# EAGLE design ottawa-badge-r2 (EAGLE 5.12)
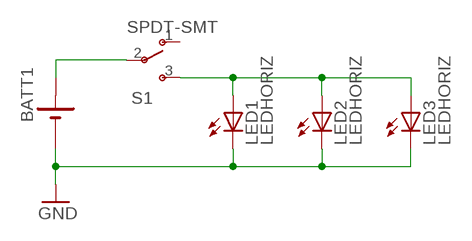
[diagram p0: schematic, sheet 1]

## Parts
BATT1  2032SMD  [2032SMD]
LED1  LEDHORIZ  [5MMLED-HORIZ]
LED2  LEDHORIZ  [5MMLED-HORIZ]
LED3  LEDHORIZ  [5MMLED-HORIZ]
S1  SPDT-SMT  [SPDT-SMT]

## Nets
GND: BATT1.- LED1.K(C) LED2.K(C) LED3.K(C)
N$1: BATT1.+ S1.2(P)
N$2: LED1.A LED2.A LED3.A S1.3(S)
Unconnected: S1.1(O)

## Library data of the parts
BATT1 = rbg-4ucon-battery:2032SMD
LED1-LED3 = artwork:LED
S1 = smt-spdt-aliexpress:SPDT-SMT

## Board
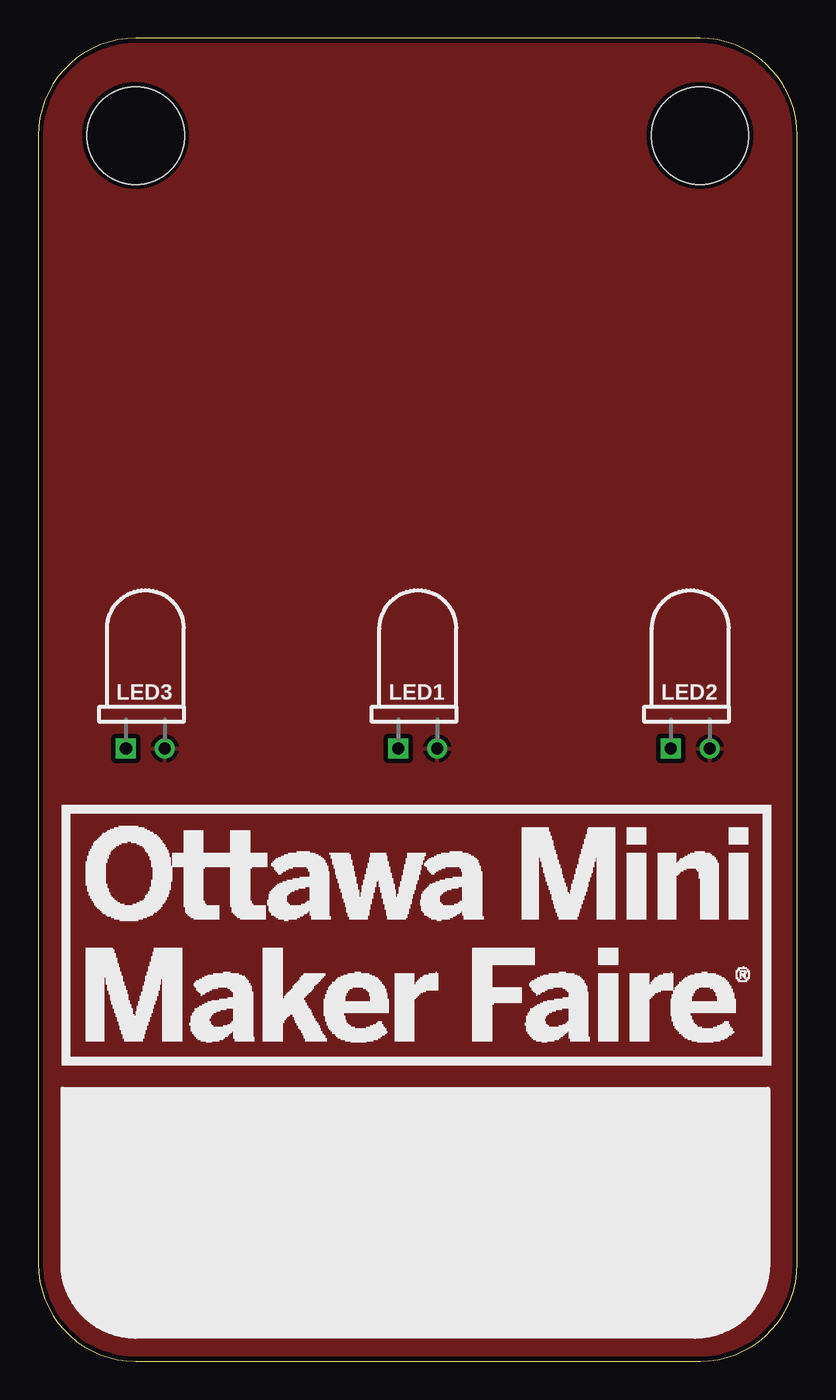
[diagram p1: board, top side]
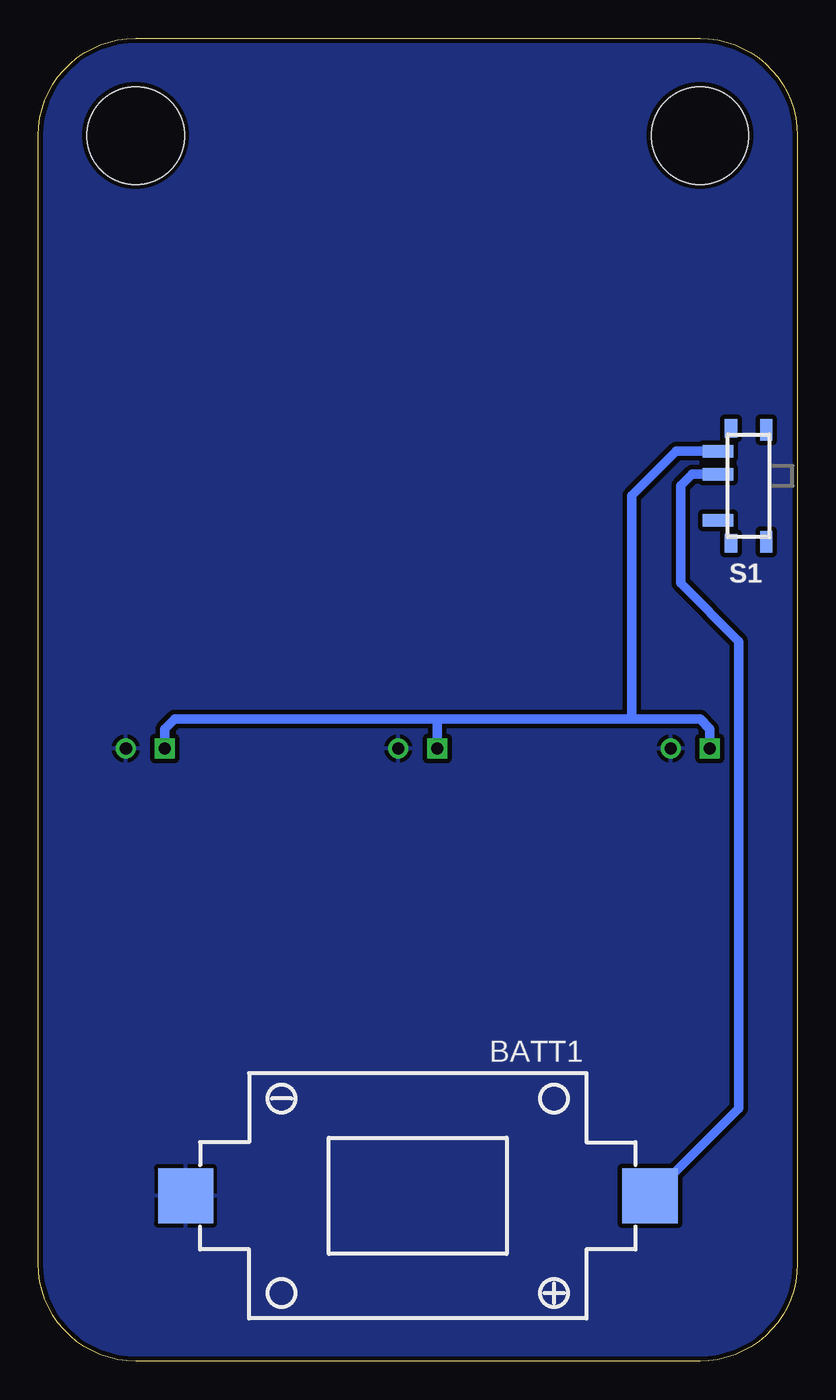
[diagram p2: board, bottom side, seen from below]

Size 49.53 x 86.36 mm. Coordinates in mm from the lower left corner, seen from the top.
Outline: 49.53,80.01 arc90 43.18,86.36 6.35,86.36 arc90 0,80.01 0,6.35 arc90 6.35,0 43.18,0 arc90 49.53,6.35 49.53,80.01
Copper layers (1*16): Top 0.035mm / dielectric 1.5mm / Bottom 0.035mm
Design rules "default *": minimum track width 10mil, minimum drill 0.6mm, track to track 8mil, track to pad 8mil, pad to pad 8mil, via to via 8mil, smd to smd 8mil, copper to edge 10mil, drill to drill 8mil, minimum pad ring 10mil, minimum via ring 8mil, stop-mask expansion 4mil, vias tented up to drill 0mil, thermal gap 10mil
Holes 6.35 mm at 6.35,80.01 43.18,80.01

### Footprints (pad centres in the part's own frame; a part is rotated, then mirrored left to right if it is on the bottom)
2032SMD = smd 3.6 x 3.6: + -15.15,0; - 15.15,0
5MMLED-HORIZ = drill 0.8 square: A -1.27,0 | drill 0.8 round: K 1.27,0
SPDT-SMT = smd 2 x 0.8: 1 -2,-2.25; 2 -2,0.75; 3 -2,2.25 | smd 0.8 x 1.2: A -1.15,3.75; D -1.15,-3.75 | smd 0.8 x 1.4: B 1.15,3.65; C 1.15,-3.65

### Placement (x,y rotation side)
BATT1  24.77,10.79 180 bottom
LED1  24.77,40.01 0 top
LED2  42.55,40.01 0 top
LED3  6.99,40.01 0 top
S1  3.17,57.15 0 bottom
U$4  [LOGO-250]  1.59,19.37 0 top
U$6  [PEACETOWER-250]  0.95,52.07 0 top

### Tracks (layer width: path | path; a pad name or v marks a point on that pad's centre or on a via)
GND
  pour Top (isolate 0.305): -1.27,87.63 51.44,87.63 51.44,-1.27 -1.27,-1.27
  pour Bottom (isolate 0.305): -1.27,87.63 51.44,87.63 51.44,-1.27 -1.27,-1.27
N$1
  Bottom 0.61: S1.2 6.87,57.9 7.62,57.15 7.62,50.8 3.81,46.99 3.81,16.51 8.8,11.52 8.89,11.52 BATT1.+
N$2
  Bottom 0.61: LED3.A 5.71,41.27 6.35,41.91 10.79,41.91 | LED2.A 41.27,41.27 40.64,41.91 23.5,41.91 | 10.79,41.91 23.5,41.91 | 23.5,41.91 LED1.A | S1.3 7.91,59.4 10.79,56.52 10.79,41.91